# Altium project AdaptadorUSBSerialRS232.PrjPcb
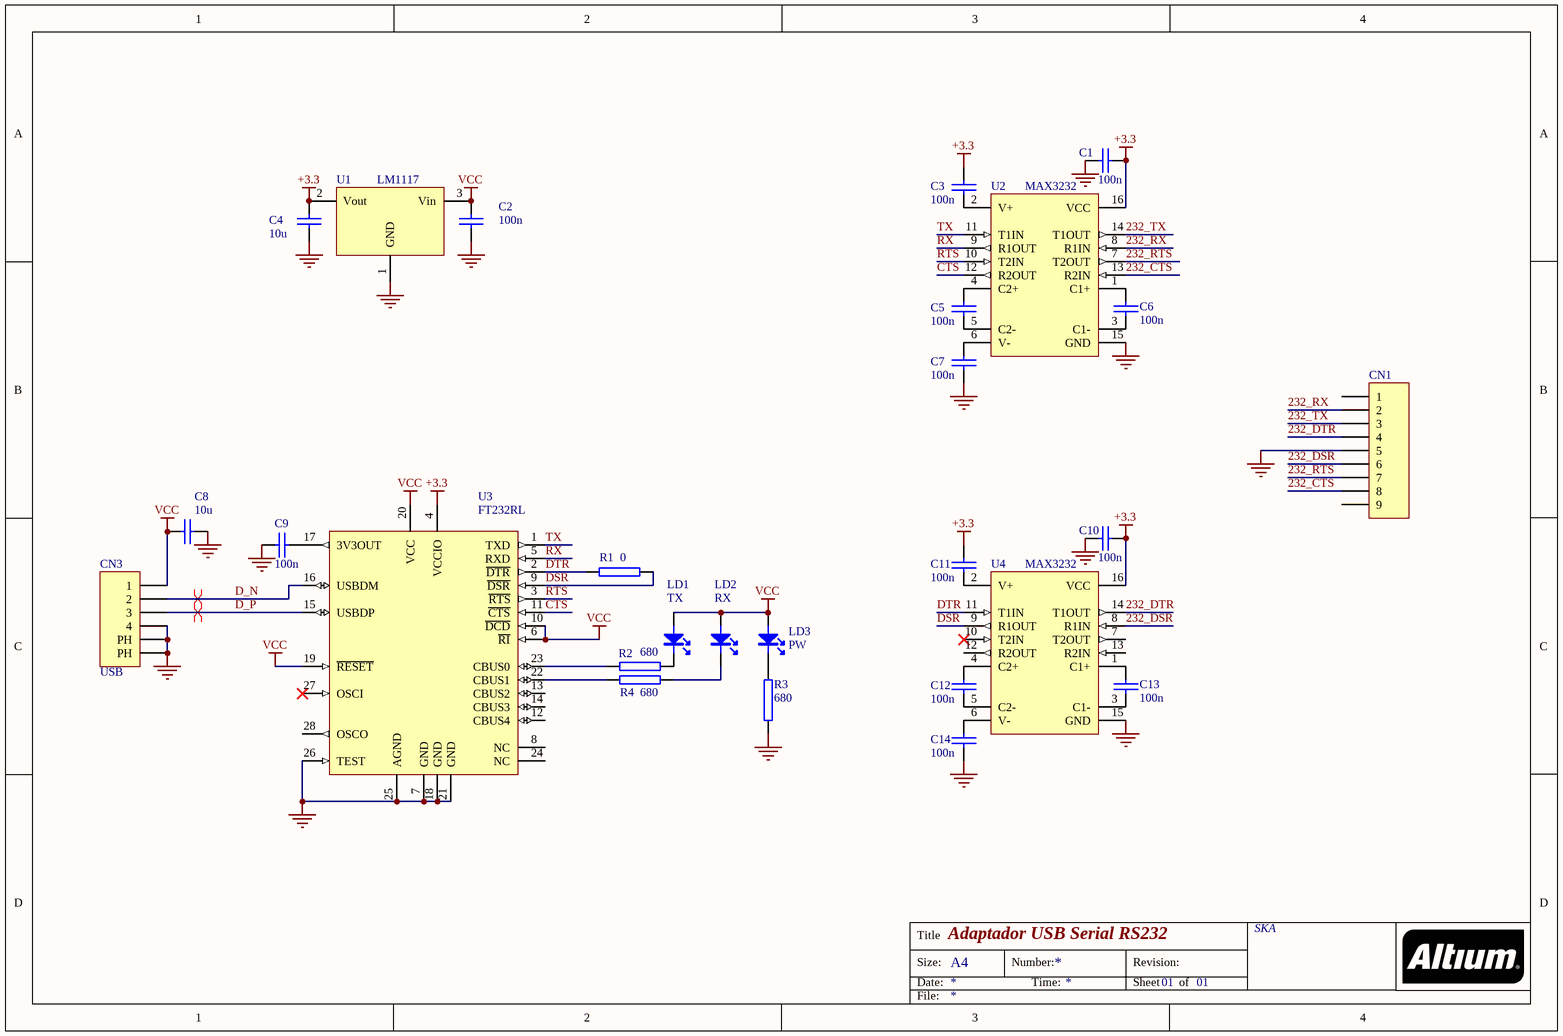
[diagram p0: AdaptadorUSBSerialRS232.SchDoc]
1 sheet, 27 parts. Net scope: global (net labels, ports and power ports of the same name join across sheets).
Board files: AdaptadorUSBSerialRS232.PcbDoc, PAINEL.PcbDoc

## Sheet AdaptadorUSBSerialRS232.SchDoc: Adaptador USB Serial RS232
size A4; PageSetup: Record=PageOptions|CenterHorizontal=True|CenterVertical=True|PrintScale=0.98|XCorrection=1.00|YCorrection=1.00|PrintKind=2|BorderSize=5000000|LeftOffset=0|BottomOffset=0|Orientation=2|PaperLength=1000|PaperWidth=1000|Scale=100|PaperSource=7|PrintQuality=-4|MediaType=1|DitherType=10|PrintScaleMode=1|PaperKind=A4 (21 x 29,7 cm); Organization: SKA; SheetNumber: 01; SheetTotal: 01; CompanyName: NC Systems; Engineer: Marcelo José Rodrigues

### Parts
C1  100n  [0805C]
C2  100n  [0805C]
C3  100n  [0805C]
C4  10u  [0805C]
C5  100n  [0805C]
C6  100n  [0805C]
C7  100n  [0805C]
C8  10u  [0805C]
C9  100n  [0805C]
C10  100n  [0805C]
C11  100n  [0805C]
C12  100n  [0805C]
C13  100n  [0805C]
C14  100n  [0805C]
CN1  DB9M  [BARRA1X9]  (value not drawn)  (no BOM)
CN3  USB  [USB-B 90]
LD1  Funcao: TX  [0805L]  (hidden comment: RED)
LD2  Funcao: RX  [0805L]  (hidden comment: RED)
LD3  Funcao: PW  [0805L]  (hidden comment: RED)
R1  0  [0805R]
R2  680  [0805R]
R3  680  [0805R]
R4  680  [0805R]
U1  LM1117  [SOT223]
U2  MAX3232  [SO16]
U3  FT232RL  [SSOP28-175-0.64]
U4  MAX3232  [SO16]

### Nets
+3.3: C1.1 C3.1 C4.1 C10.1 C11.1 U1.2(Vout) U2.16(VCC) U3.4(VCCIO) U4.16(VCC)
GND: C1.2 C2.2 C4.2 C7.2 C8.2 C9.2 C10.2 C14.2 CN1.5 CN3.4 CN3.PH2(PH) CN3.PH3(PH) R3.1 U1.1(GND) U2.15(GND) U3.7(GND) U3.18(GND) U3.21(GND) U3.25(AGND) U3.26(TEST) U4.15(GND)
VCC: C2.1 C8.1 CN3.1 LD1.2(A) LD2.2(A) LD3.2(A) U1.3(Vin) U3.6(~{RI}) U3.10(~{DCD}) U3.19(~{RESET}) U3.20(VCC)
232_CTS: CN1.8 U2.13(R2IN)
232_DSR: CN1.6 U4.8(R1IN)
232_DTR: CN1.4 U4.14(T1OUT)
232_RTS: CN1.7 U2.7(T2OUT)
232_RX: CN1.2 U2.8(R1IN)
232_TX: CN1.3 U2.14(T1OUT)
CTS: U2.12(R2OUT) U3.11(~{CTS})
D_N: CN3.2 U3.16(USBDM)
D_P: CN3.3 U3.15(USBDP)
DSR: R1.2 U3.9(~{DSR}) U4.9(R1OUT)
DTR: R1.1 U3.2(~{DTR}) U4.11(T1IN)
RTS: U2.10(T2IN) U3.3(~{RTS})
RX: U2.9(R1OUT) U3.5(RXD)
TX: U2.11(T1IN) U3.1(TXD)
NetC3_2: C3.2 U2.2(V+)
NetC5_1: C5.1 U2.4(C2+)
NetC5_2: C5.2 U2.5(C2-)
NetC6_1: C6.1 U2.1(C1+)
NetC6_2: C6.2 U2.3(C1-)
NetC7_1: C7.1 U2.6(V-)
NetC9_1: C9.1 U3.17(3V3OUT)
NetC11_2: C11.2 U4.2(V+)
NetC12_1: C12.1 U4.4(C2+)
NetC12_2: C12.2 U4.5(C2-)
NetC13_1: C13.1 U4.1(C1+)
NetC13_2: C13.2 U4.3(C1-)
NetC14_1: C14.1 U4.6(V-)
NetLD1_1: LD1.1(K) R2.2
NetLD2_1: LD2.1(K) R4.2
NetLD3_1: LD3.1(K) R3.2
NetR2_1: R2.1 U3.23(CBUS0)
NetR4_1: R4.1 U3.22(CBUS1)

Not connected (* = marked no-connect by the designer): CN1 1 9; U3 8(NC) 12(CBUS4) 13(CBUS2) 14(CBUS3) 24(NC) 27(OSCI)* 28(OSCO); U4 7(T2OUT) 10(T2IN)* 12(R2OUT) 13(R2IN)

### Layout directives
differential pair: D_N, D_P

### Notes on the sheet
- Title
- Size:
- Date:
- A4
- Number:
- Time:
- Revision:
- Sheet
- of
- File:

### Library data of the parts
C1-C3 C5-C7 C10-C14 = CAP: CAPACITOR SMD 0805 100nF/50V X7R; Meu PN: 10.10.104
C4 C8 = CAP: CAPACITOR SMD 0805 10UF/6,3V X7R; Meu PN: 10.10.106
C9 = CAP: CAPACITOR SMD 0805 100NF/50V X7R; Meu PN: 10.10.104
CN1 = Header 9: Espera para DB9 M
CN3 = Header 6: CONECTOR USB; Meu PN: 11.10.001
LD1-LD3 = LED: LED 0805 VERMELHO; Meu PN: 10.11.001
R1 = RES: RESISTOR SMD 0805 0 OHM (JUMPER); Meu PN: 10.12.000
R2-R4 = RES: RESISTOR SMD 0805 680 OHM; Meu PN: 10.12.681
U1 = LM1117: REGULADOR LINEAR SMD LM1117MPX-3.3; Meu PN: 10.13.117
U2 U4 = MAX232: CI SMD MAX3232 SO16 NARROW; Meu PN: 10.13.323
U3 = CMP-0078-00027-1: USB UART FT232RL, SSOP-28, Tray; Supplier 1: Digikey; Supplier Part Number 1: 768-1007-6-ND

## Assembly variants
Sem LEDs + DTR & DSR: not fitted LD1 LD2 LD3 R1 R2 R3 R4